# Altium schematic sheet DS3231-RTC.SchDoc
size A4
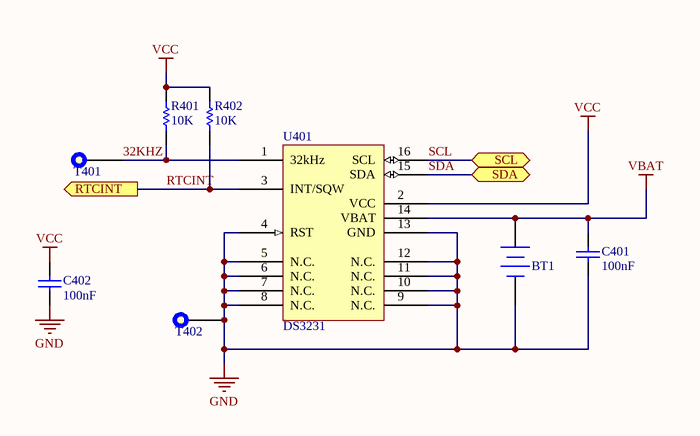
[diagram p0: DS3231-RTC.SchDoc]

## Parts
BT1  Battery  [2032HOLDER]  (value not drawn)
C401  value 100nF  [RCL 0805]  (hidden comment: Cap)
C402  value 100nF  [RCL 0805]  (hidden comment: Cap)
R401  value 10K  [RCL 0805]  (hidden comment: Res Semi)
R402  value 10K  [RCL 0805]  (hidden comment: Res Semi)
T401  TESTPOINT  [TEST POINT 1]  (value not drawn)
T402  TESTPOINT  [TEST POINT 1]  (value not drawn)
U401  DS3231  [WSO16_M]

## Ports
RTCINT (out), SCL (bidir), SDA (bidir)

## Nets
GND: BT1.2(-) C401.1 C402.1 T402.1(TST) U401.4(RST) U401.5(N.C.) U401.6(N.C.) U401.7(N.C.) U401.8(N.C.) U401.9(N.C.) U401.10(N.C.) U401.11(N.C.) U401.12(N.C.) U401.13(GND)
VBAT: BT1.1(+) C401.2 U401.14(VBAT)
VCC: C402.2 R401.2 R402.2 U401.2(VCC)
32KHZ: R401.1 T401.1(TST) U401.1(32kHz)
RTCINT: R402.1 U401.3(INT/SQW) ; port RTCINT
SCL: U401.16(SCL) ; port SCL
SDA: U401.15(SDA) ; port SDA

## Library data of the parts
BT1 = Battery: Multicell Battery; Published: 24-Mar-1999; LatestRevisionDate: 17-Jul-2002; LatestRevisionNote: Re-released for DXP Platform.; PackageReference: BAT-2; Publisher: Altium Limited
C401 C402 = Cap: Capacitor; Published: 8-Jun-2000; LatestRevisionDate: 17-Jul-2002; LatestRevisionNote: Re-released for DXP Platform.; PackageReference: RAD-0.3; Publisher: Altium Limited
R401 R402 = Res Semi: Semiconductor Resistor; Published: 8-Jun-2000; LatestRevisionDate: 17-Jul-2002; LatestRevisionNote: Re-released for DXP Platform.; PackageReference: AXIAL-0.5; Publisher: Altium Limited
U401 = DS3231: Extremely Accurate I²C-Integrated RTC/TCXO/Crystal